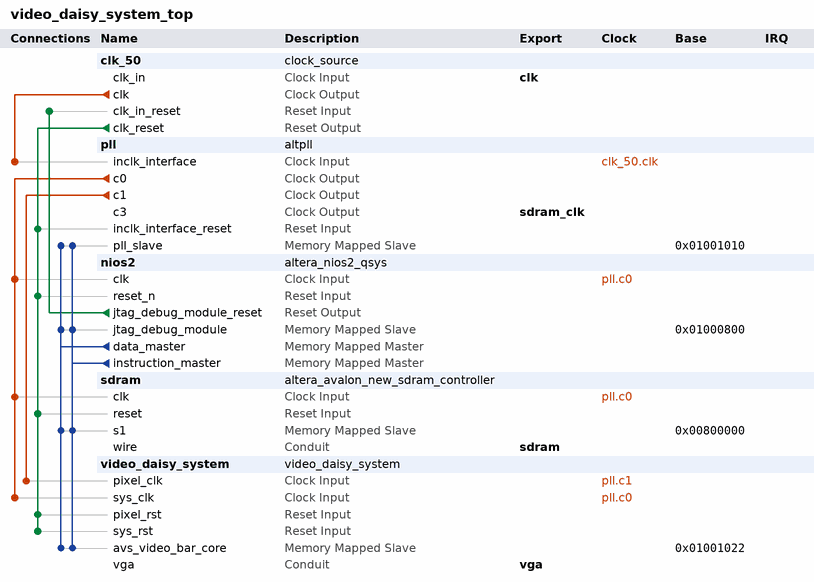
[diagram p0: system contents]
# Platform Designer (Qsys) system video_daisy_system_top, Cyclone II Unknown
# Parameters at their usual value, and those the tool derives, are not listed.
package require -exact qsys 13.0
create_system video_daisy_system_top
set_project_property DEVICE_FAMILY {Cyclone II}
set_project_property DEVICE Unknown

add_instance clk_50 clock_source 13.0
set_instance_parameter_value clk_50 clockFrequency 50000000

add_instance pll altpll 13.0
set_instance_parameter_value pll INCLK0_INPUT_FREQUENCY 20000
set_instance_parameter_value pll CLK0_MULTIPLY_BY 2
set_instance_parameter_value pll CLK1_MULTIPLY_BY 1
set_instance_parameter_value pll CLK3_MULTIPLY_BY 2
set_instance_parameter_value pll CLK0_DIVIDE_BY 1
set_instance_parameter_value pll CLK1_DIVIDE_BY 2
set_instance_parameter_value pll CLK3_DIVIDE_BY 1
set_instance_parameter_value pll CLK1_PHASE_SHIFT 0
set_instance_parameter_value pll CLK3_PHASE_SHIFT -3000
set_instance_parameter_value pll CLK1_DUTY_CYCLE 50
set_instance_parameter_value pll CLK3_DUTY_CYCLE 50
set_instance_parameter_value pll PORT_clk1 PORT_USED
set_instance_parameter_value pll PORT_clk2 PORT_UNUSED
set_instance_parameter_value pll PORT_clk3 PORT_USED
set_instance_parameter_value pll PORT_ARESET PORT_UNUSED
set_instance_parameter_value pll PORT_LOCKED PORT_UNUSED

add_instance nios2 altera_nios2_qsys 13.0
set_instance_parameter_value nios2 resetSlave sdram.s1
set_instance_parameter_value nios2 mmu_TLBMissExcSlave None
set_instance_parameter_value nios2 exceptionSlave sdram.s1
set_instance_parameter_value nios2 breakSlave nios2.jtag_debug_module
set_instance_parameter_value nios2 impl Tiny
set_instance_parameter_value nios2 icache_size 4096

add_instance sdram altera_avalon_new_sdram_controller 13.0.1.99.2
set_instance_parameter_value sdram TAC 5.5
set_instance_parameter_value sdram TRCD 20.0
set_instance_parameter_value sdram TRP 20.0
set_instance_parameter_value sdram casLatency 3
set_instance_parameter_value sdram columnWidth 8
set_instance_parameter_value sdram dataWidth 16
set_instance_parameter_value sdram generateSimulationModel false
set_instance_parameter_value sdram model single_Micron_MT48LC4M32B2_7_chip
set_instance_parameter_value sdram numberOfBanks 4
set_instance_parameter_value sdram numberOfChipSelects 1
set_instance_parameter_value sdram powerUpDelay 100.0
set_instance_parameter_value sdram refreshPeriod 15.625
set_instance_parameter_value sdram rowWidth 12

add_instance video_daisy_system video_daisy_system 1.0
set_instance_parameter_value video_daisy_system RSIZE 4
set_instance_parameter_value video_daisy_system GSIZE 4
set_instance_parameter_value video_daisy_system BSIZE 4
set_instance_parameter_value video_daisy_system RGB_SIZE 12

# connections
add_connection clk_50.clk pll.inclk_interface clock
add_connection pll.c0 nios2.clk clock
add_connection pll.c0 sdram.clk clock
add_connection pll.c0 video_daisy_system.sys_clk clock
add_connection pll.c1 video_daisy_system.pixel_clk clock
add_connection clk_50.clk_reset nios2.reset_n reset
add_connection clk_50.clk_reset pll.inclk_interface_reset reset
add_connection clk_50.clk_reset sdram.reset reset
add_connection clk_50.clk_reset video_daisy_system.pixel_rst reset
add_connection clk_50.clk_reset video_daisy_system.sys_rst reset
add_connection nios2.jtag_debug_module_reset clk_50.clk_in_reset reset
add_connection nios2.data_master nios2.jtag_debug_module avalon
set_connection_parameter_value nios2.data_master/nios2.jtag_debug_module baseAddress 0x01000800
add_connection nios2.data_master pll.pll_slave avalon
set_connection_parameter_value nios2.data_master/pll.pll_slave baseAddress 0x01001010
add_connection nios2.data_master sdram.s1 avalon
set_connection_parameter_value nios2.data_master/sdram.s1 baseAddress 0x00800000
add_connection nios2.data_master video_daisy_system.avs_video_bar_core avalon
set_connection_parameter_value nios2.data_master/video_daisy_system.avs_video_bar_core baseAddress 0x01001022
add_connection nios2.instruction_master nios2.jtag_debug_module avalon
set_connection_parameter_value nios2.instruction_master/nios2.jtag_debug_module baseAddress 0x01000800
add_connection nios2.instruction_master pll.pll_slave avalon
set_connection_parameter_value nios2.instruction_master/pll.pll_slave baseAddress 0x01001010
add_connection nios2.instruction_master sdram.s1 avalon
set_connection_parameter_value nios2.instruction_master/sdram.s1 baseAddress 0x00800000
add_connection nios2.instruction_master video_daisy_system.avs_video_bar_core avalon
set_connection_parameter_value nios2.instruction_master/video_daisy_system.avs_video_bar_core baseAddress 0x01001022

# exported interfaces
add_interface sdram_clk clock source
set_interface_property sdram_clk EXPORT_OF pll.c3
add_interface sdram conduit end
set_interface_property sdram EXPORT_OF sdram.wire
add_interface vga conduit end
set_interface_property vga EXPORT_OF video_daisy_system.vga
add_interface clk clock sink
set_interface_property clk EXPORT_OF clk_50.clk_in

set_interconnect_requirement {$system} qsys_mm.clockCrossingAdapter HANDSHAKE
set_interconnect_requirement {$system} qsys_mm.maxAdditionalLatency 1

save_system video_daisy_system_top.qsys
